# EAGLE design stm32-2inch40-usb-sd (EAGLE 6.6.0)
USB/SD 40 pin mesonine module. 2 inch beetween pinheads.

## Sheet 1 of 2
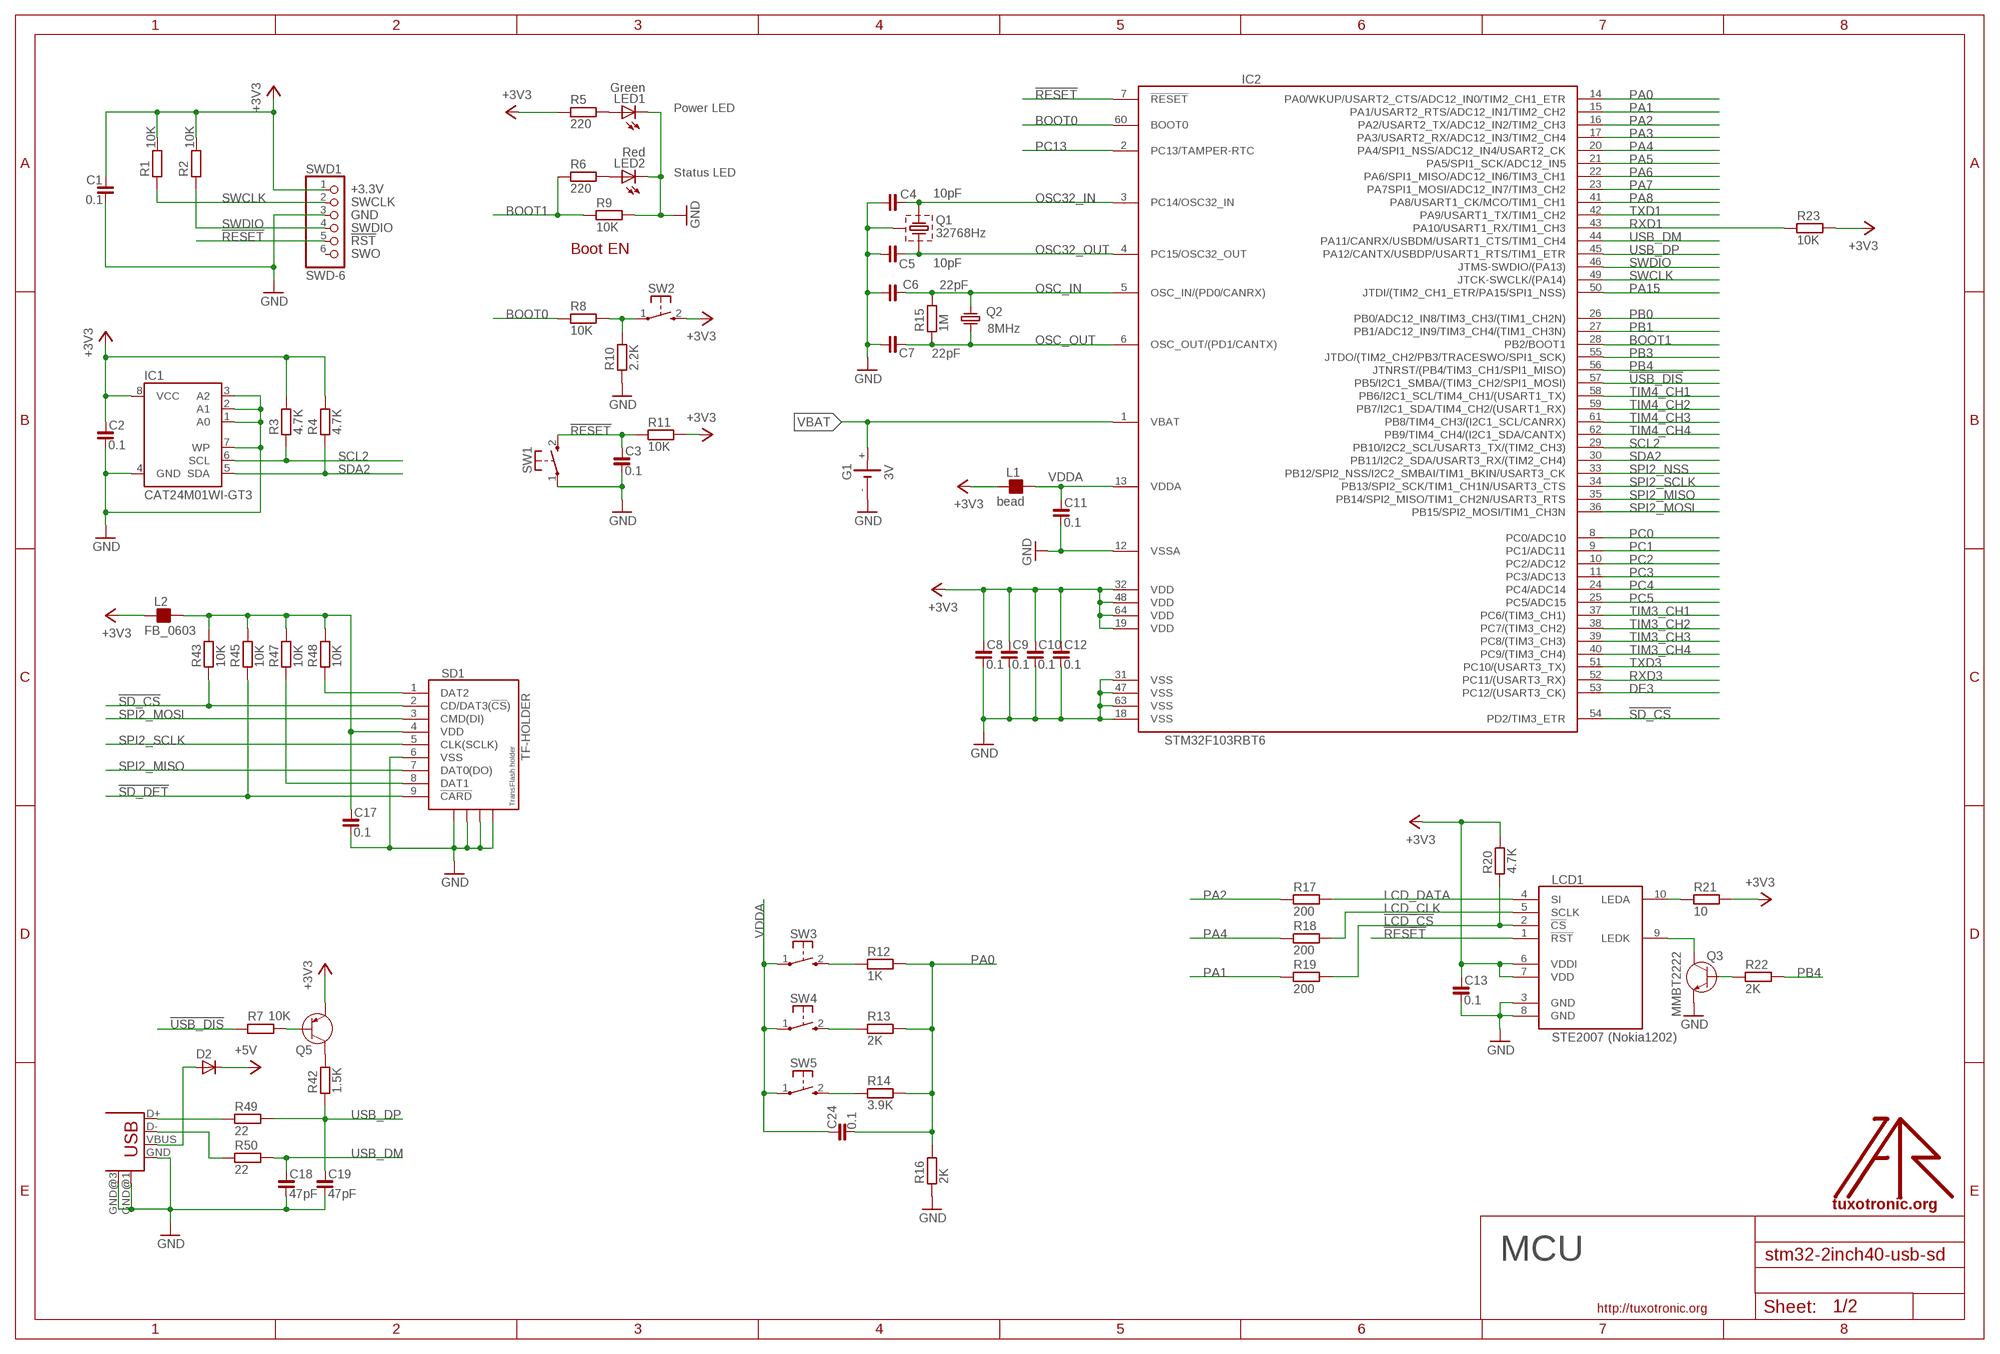
[diagram p0: schematic, sheet 1]

### Parts
C1  0.1  C_0603  [C0603]
C2  0.1  C_0603  [C0603]
C3  0.1  C_0603  [C0603]
C4  10pF  C_0603  [C0603]
C5  10pF  C_0603  [C0603]
C6  22pF  C_0603  [C0603]
C7  22pF  C_0603  [C0603]
C8  0.1  C_0603  [C0603]
C9  0.1  C_0603  [C0603]
C10  0.1  C_0603  [C0603]
C11  0.1  C_0603  [C0603]
C12  0.1  C_0603  [C0603]
C13  0.1  C_0603  [C0603]
C17  0.1  C_0603  [C0603]
C18  47pF  C_0603  [C0603]
C19  47pF  C_0603  [C0603]
C24  0.1  C_0603  [C0603]
D2  D-SOD-87  [SOD87]
G1  3V  1220SMT  [SMT1220]
IC1  CAT24M01WI-GT3  AT24C256S  [SO08]
IC2  STM32F103RBT6  STM32F103R  [TQFP64]
L1  bead  FB_0603  [L0603]
L2  FB_0603  [L0603]
LCD1  STE2007 (Nokia1202)  LCD1202-EXT  [NOKIA1202LCD-EXT]
LED1  Green  LEDCHIP-LED0805  [CHIP-LED0805]
LED2  Red  LEDCHIP-LED0805  [CHIP-LED0805]
Q1  32768Hz  CRSTL3-  [TC38H-G]
Q2  8MHz  CRYSTAL-HC49S  [HC49/S]
Q3  MMBT2222  [SOT23]
Q5  PNP-SOT23  [SOT23]
R1  10K  R_0603  [R0603]
R2  10K  R_0603  [R0603]
R3  4.7K  R_0603  [R0603]
R4  4.7K  R_0603  [R0603]
R5  220  R_0603  [R0603]
R6  220  R_0603  [R0603]
R7  10K  R_0603  [R0603]
R8  10K  R_0603  [R0603]
R9  10K  R_0603  [R0603]
R10  2.2K  R_0603  [R0603]
R11  10K  R_0603  [R0603]
R12  1K  R_0603  [R0603]
R13  2K  R_0603  [R0603]
R14  3.9K  R_0603  [R0603]
R15  1M  R_0603  [R0603]
R16  2K  R_0603  [R0603]
R17  200  R_0603  [R0603]
R18  200  R_0603  [R0603]
R19  200  R_0603  [R0603]
R20  4.7K  R_0603  [R0603]
R21  10  R_0603  [R0603]
R22  2K  R_0603  [R0603]
R23  10K  R_0603  [R0603]
R42  1.5K  R_0603  [R0603]
R43  10K  R_0603  [R0603]
R45  10K  R_0603  [R0603]
R47  10K  R_0603  [R0603]
R48  10K  R_0603  [R0603]
R49  22  R_0603  [R0603]
R50  22  R_0603  [R0603]
SD1  TF-HOLDER  [TF-PULL]
SW1  KSS-2EG4430  [KSS-2EG4430]
SW2  KSS-2EG4430  [KSS-2EG4430]
SW3  KSS-2EG4430  [KSS-2EG4430]
SW4  KSS-2EG4430  [KSS-2EG4430]
SW5  KSS-2EG4430  [KSS-2EG4430]
SWD1  SWD-6  [JTAG6PIN]
U$1  LOGO  [TT_LOGO]
USB1  USB-MB-S  [USB-MB-S]

### Nets
!LCD_CS: LCD1.2(!CS) R19.2 R20.1
!RESET: C3.1 IC2.7(!RESET) LCD1.1(!RST) R11.1 SW1.2(S) SWD1.5
!SD_CS: IC2.54(PD2/TIM3_ETR) R43.1 SD1.2(CD/DAT3(!CS!))
!SD_DET: R45.1 SD1.9(!CARD)
!USB_DIS: IC2.57(PB5/I2C1_SMBA/(TIM3_CH2/SPI1_MOSI)) R7.1
+3V3: C1.1 C2.1 C8.1 C9.1 C10.1 C12.1 C13.1 IC1.8(VCC) IC2.19(VDD) IC2.32(VDD) IC2.48(VDD) IC2.64(VDD) L1.1 L2.1 LCD1.6(VDDI) LCD1.7(VDD) Q5.2(E) R1.2 R2.2 R3.2 R4.2 R5.1 R11.2 R20.2 R21.2 R23.2 SW2.2(S) SWD1.1 ; also sheet 2
+5V: D2.1(C) ; also sheet 2
BOOT0: IC2.60(BOOT0) R8.1
BOOT1: IC2.28(PB2/BOOT1) R6.1 R9.1
DE3: IC2.53(PC12/(USART3_CK)) ; also sheet 2
GND: C1.2 C2.2 C3.2 C4.2 C5.2 C6.2 C7.2 C8.2 C9.2 C10.2 C11.2 C12.2 C13.2 C17.2 C18.2 C19.2 G1.- IC1.1(A0) IC1.2(A1) IC1.3(A2) IC1.4(GND) IC1.7(WP) IC2.12(VSSA) IC2.18(VSS) IC2.31(VSS) IC2.47(VSS) IC2.63(VSS) LCD1.3(GND) LCD1.8(GND) LED1.C LED2.C Q1.GND Q3.2(E) R9.2 R10.1 R16.1 SD1.6(VSS) SD1.S1 SD1.S2 SD1.S3 SD1.S4 SW1.1(P) SWD1.3 USB1.GND USB1.GND@1(GND) USB1.GND@3(GND) ; also sheet 2
LCD_CLK: LCD1.5(SCLK) R18.2
LCD_DATA: LCD1.4(SI) R17.2
N$1: Q5.3(C) R42.2
N$2: D2.2(A) USB1.VBUS
N$3: R8.2 R10.2 SW2.1(P)
N$7: C17.1 L2.2 R43.2 R45.2 R47.2 R48.2 SD1.4(VDD)
N$8: R48.1 SD1.1(DAT2)
N$9: R47.1 SD1.8(DAT1)
N$10: R49.1 USB1.D+
N$13: LED1.A R5.2
N$29: LCD1.9(LEDK) Q3.3(C)
N$30: LED2.A R6.2
N$31: LCD1.10(LEDA) R21.1
N$32: Q3.1(B) R22.1
N$33: R12.1 SW3.2(S)
N$34: R13.1 SW4.2(S)
N$35: R14.1 SW5.2(S)
N$36: R50.1 USB1.D-
N$38: Q5.1(B) R7.2
OSC32_IN: C4.1 IC2.3(PC14/OSC32_IN) Q1.2
OSC32_OUT: C5.1 IC2.4(PC15/OSC32_OUT) Q1.1
OSC_IN: C6.1 IC2.5(OSC_IN/(PD0/CANRX)) Q2.1 R15.2
OSC_OUT: C7.1 IC2.6(OSC_OUT/(PD1/CANTX)) Q2.2 R15.1
PA0: C24.2 IC2.14(PA0/WKUP/USART2_CTS/ADC12_IN0/TIM2_CH1_ETR) R12.2 R13.2 R14.2 R16.2 ; also sheet 2
PA1: IC2.15(PA1/USART2_RTS/ADC12_IN1/TIM2_CH2) R19.1 ; also sheet 2
PA2: IC2.16(PA2/USART2_TX/ADC12_IN2/TIM2_CH3) R17.1 ; also sheet 2
PA3: IC2.17(PA3/USART2_RX/ADC12_IN3/TIM2_CH4) ; also sheet 2
PA4: IC2.20(PA4/SPI1_NSS/ADC12_IN4/USART2_CK) R18.1 ; also sheet 2
PA5: IC2.21(PA5/SPI1_SCK/ADC12_IN5) ; also sheet 2
PA6: IC2.22(PA6/SPI1_MISO/ADC12_IN6/TIM3_CH1) ; also sheet 2
PA7: IC2.23(PA7SPI1_MOSI/ADC12_IN7/TIM3_CH2) ; also sheet 2
PA8: IC2.41(PA8/USART1_CK/MCO/TIM1_CH1) ; also sheet 2
PA15: IC2.50(JTDI/(TIM2_CH1_ETR/PA15/SPI1_NSS)) ; also sheet 2
PB0: IC2.26(PB0/ADC12_IN8/TIM3_CH3/(TIM1_CH2N)) ; also sheet 2
PB1: IC2.27(PB1/ADC12_IN9/TIM3_CH4/(TIM1_CH3N)) ; also sheet 2
PB3: IC2.55(JTDO/(TIM2_CH2/PB3/TRACESWO/SPI1_SCK)) ; also sheet 2
PB4: IC2.56(JTNRST/(PB4/TIM3_CH1/SPI1_MISO)) R22.2
PC0: IC2.8(PC0/ADC10) ; also sheet 2
PC1: IC2.9(PC1/ADC11) ; also sheet 2
PC2: IC2.10(PC2/ADC12) ; also sheet 2
PC3: IC2.11(PC3/ADC13) ; also sheet 2
PC4: IC2.24(PC4/ADC14) ; also sheet 2
PC5: IC2.25(PC5/ADC15) ; also sheet 2
PC13: IC2.2(PC13/TAMPER-RTC) ; also sheet 2
RXD1: IC2.43(PA10/USART1_RX/TIM1_CH3) R23.1 ; also sheet 2
RXD3: IC2.52(PC11/(USART3_RX)) ; also sheet 2
SCL2: IC1.6(SCL) IC2.29(PB10/I2C2_SCL/USART3_TX/(TIM2_CH3)) R3.1 ; also sheet 2
SDA2: IC1.5(SDA) IC2.30(PB11/I2C2_SDA/USART3_RX/(TIM2_CH4)) R4.1 ; also sheet 2
SPI2_MISO: IC2.35(PB14/SPI2_MISO/TIM1_CH2N/USART3_RTS) SD1.7(DAT0(DO)) ; also sheet 2
SPI2_MOSI: IC2.36(PB15/SPI2_MOSI/TIM1_CH3N) SD1.3(CMD(DI)) ; also sheet 2
SPI2_NSS: IC2.33(PB12/SPI2_NSS/I2C2_SMBAI/TIM1_BKIN/USART3_CK) ; also sheet 2
SPI2_SCLK: IC2.34(PB13/SPI2_SCK/TIM1_CH1N/USART3_CTS) SD1.5(CLK(SCLK)) ; also sheet 2
SWCLK: IC2.49(JTCK-SWCLK/(PA14)) R1.1 SWD1.2
SWDIO: IC2.46(JTMS-SWDIO/(PA13)) R2.1 SWD1.4
TIM3_CH1: IC2.37(PC6/(TIM3_CH1)) ; also sheet 2
TIM3_CH2: IC2.38(PC7/(TIM3_CH2)) ; also sheet 2
TIM3_CH3: IC2.39(PC8/(TIM3_CH3)) ; also sheet 2
TIM3_CH4: IC2.40(PC9/(TIM3_CH4)) ; also sheet 2
TIM4_CH1: IC2.58(PB6/I2C1_SCL/TIM4_CH1/(USART1_TX)) ; also sheet 2
TIM4_CH2: IC2.59(PB7/I2C1_SDA/TIM4_CH2/(USART1_RX)) ; also sheet 2
TIM4_CH3: IC2.61(PB8/TIM4_CH3/(I2C1_SCL/CANRX)) ; also sheet 2
TIM4_CH4: IC2.62(PB9/TIM4_CH4/(I2C1_SDA/CANTX)) ; also sheet 2
TXD1: IC2.42(PA9/USART1_TX/TIM1_CH2) ; also sheet 2
TXD3: IC2.51(PC10/(USART3_TX)) ; also sheet 2
USB_DM: C18.1 IC2.44(PA11/CANRX/USBDM/USART1_CTS/TIM1_CH4) R50.2
USB_DP: C19.1 IC2.45(PA12/CANTX/USBDP/USART1_RTS/TIM1_ETR) R42.1 R49.2
VBAT: G1.+ IC2.1(VBAT)
VDDA: C11.1 C24.1 IC2.13(VDDA) L1.2 SW3.1(P) SW4.1(P) SW5.1(P)
Unconnected: SWD1.6

### Notes on the sheet
- Power LED
- Status LED
- Boot EN
- MCU

## Sheet 2 of 2
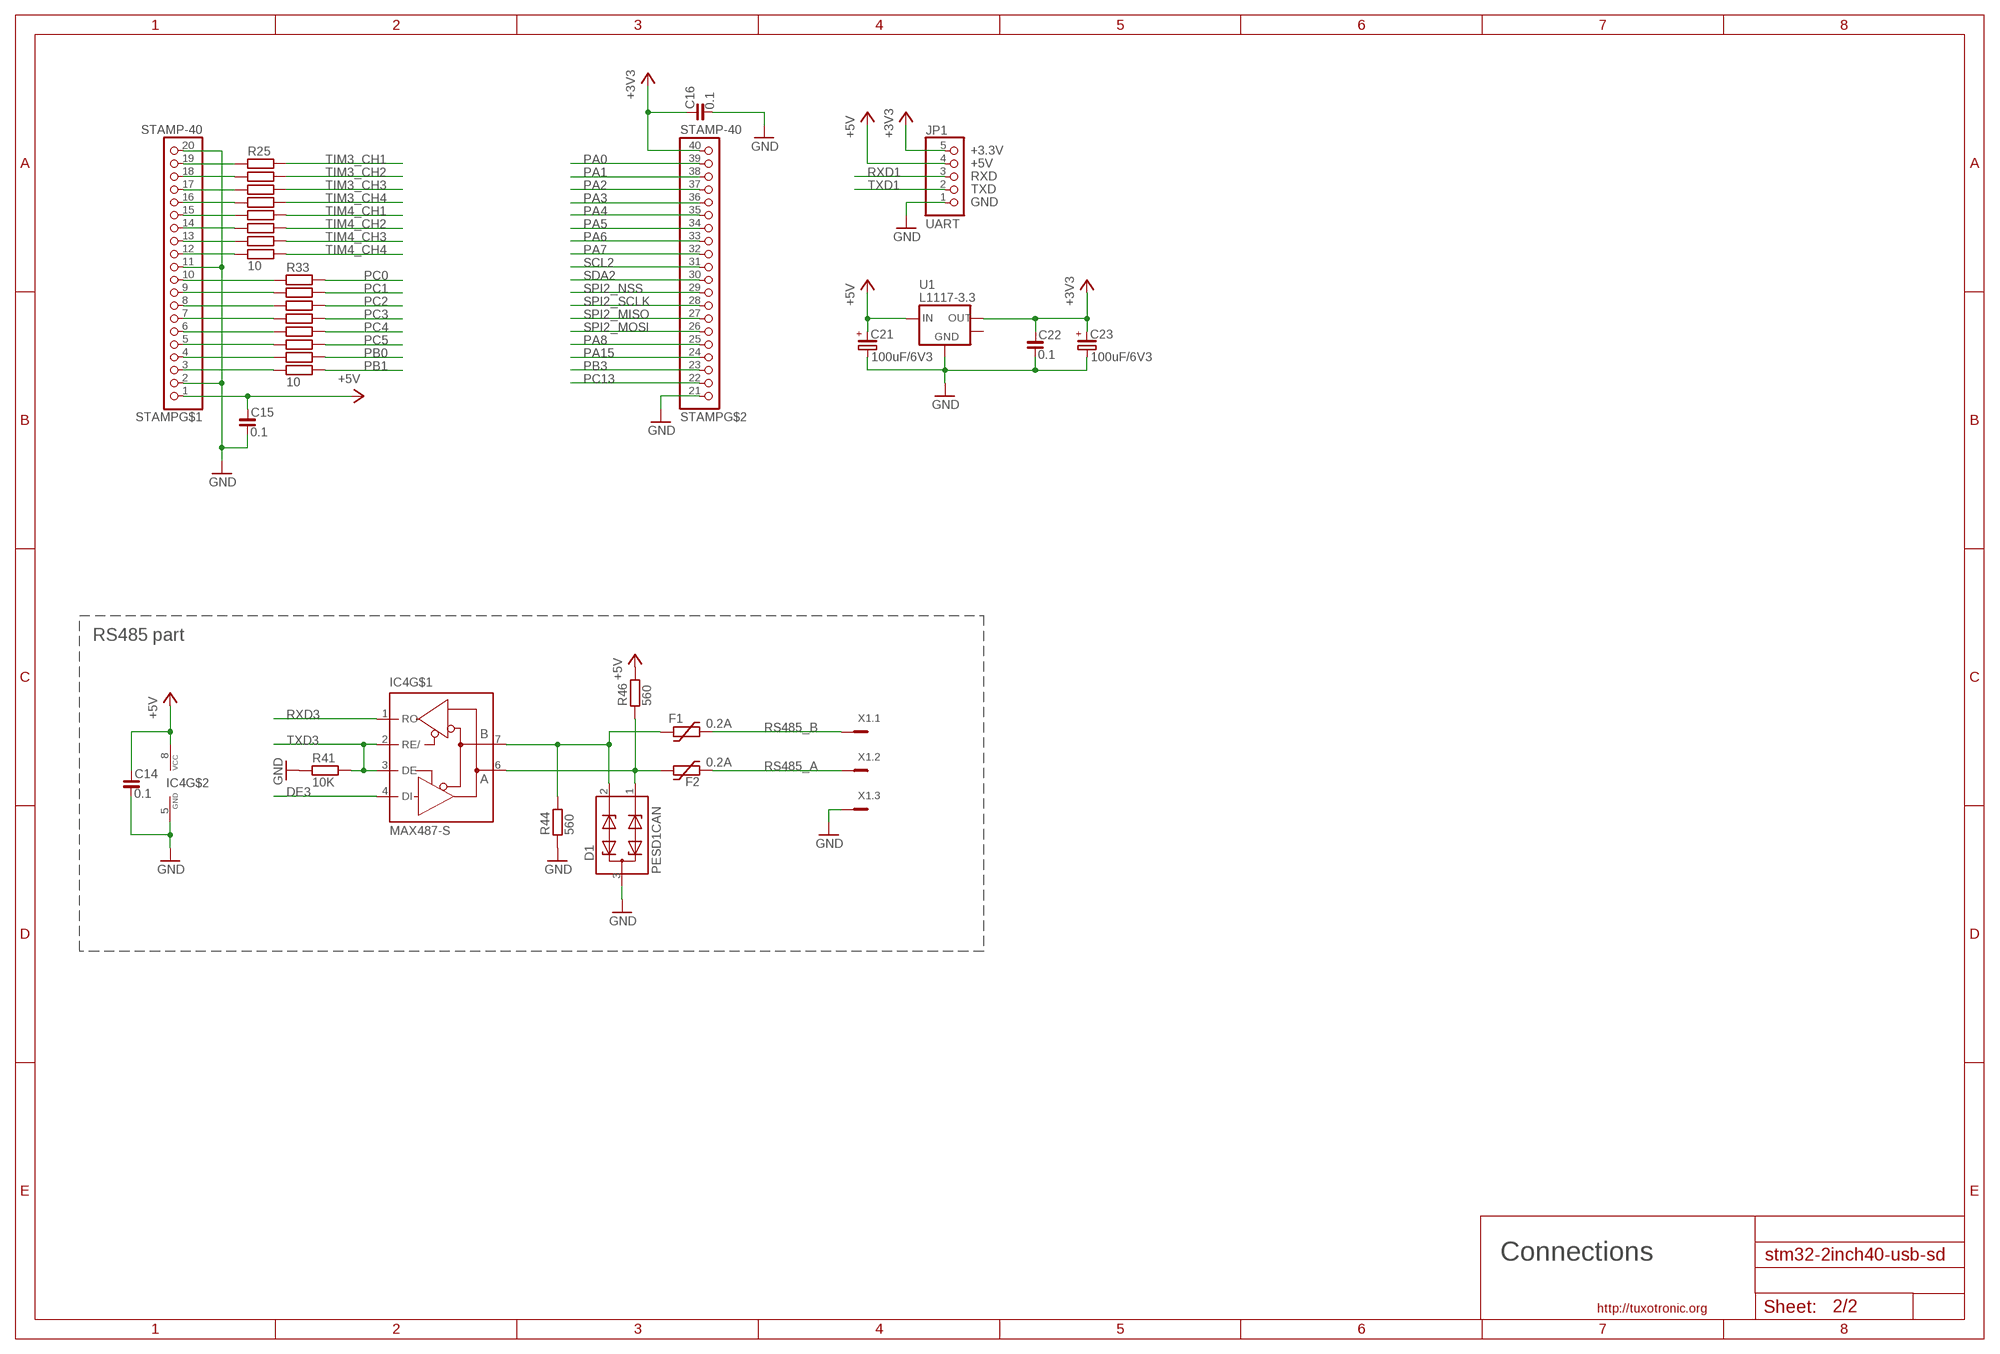
[diagram p1: schematic, sheet 2]

### Parts
C14  0.1  C_0603  [C0603]
C15  0.1  C_0805  [C0805]
C16  0.1  C_0805  [C0805]
C21  100uF/6V3  CP_SMCD  [SMC_D]
C22  0.1  C_0805  [C0805]
C23  100uF/6V3  CP_SMCD  [SMC_D]
D1  PESD1CAN  [SOT23]
F1  0.2A  1206L  [1206L]
F2  0.2A  1206L  [1206L]
IC4  MAX487-S  [SO08]
JP1  UART  UART-5_2.54  [UART_1X05]
R25  10  R_0603  [R0603]
R26  10  R_0603  [R0603]
R27  10  R_0603  [R0603]
R28  10  R_0603  [R0603]
R29  10  R_0603  [R0603]
R30  10  R_0603  [R0603]
R31  10  R_0603  [R0603]
R32  10  R_0603  [R0603]
R33  10  R_0603  [R0603]
R34  10  R_0603  [R0603]
R35  10  R_0603  [R0603]
R36  10  R_0603  [R0603]
R37  10  R_0603  [R0603]
R38  10  R_0603  [R0603]
R39  10  R_0603  [R0603]
R40  10  R_0603  [R0603]
R41  10K  R_0603  [R0603]
R44  560  R_0603  [R0603]
R46  560  R_0603  [R0603]
STAMP  STAMP-40  [STAMP-40]
U1  L1117-3.3  LM1117-3.3  [SOT223]
X1  MCV3  [MCV3]

### Nets
+3V3: C16.1 C22.1 C23.+ JP1.5 STAMP.40 U1.2(OUT) ; also sheet 1
+5V: C14.1 C15.1 C21.+ IC4.8(VCC) JP1.4 R46.2 STAMP.1 U1.3(IN) ; also sheet 1
DE3: IC4.4(DI) ; also sheet 1
GND: C14.2 C15.2 C16.2 C21.- C22.2 C23.- D1.3 IC4.5(GND) JP1.1 R41.1 R44.1 STAMP.2 STAMP.11 STAMP.20 STAMP.21 U1.1(GND) X1.3 ; also sheet 1
N$6: D1.2 F1.P$1 IC4.7(B) R44.2
N$11: R33.1 STAMP.10
N$14: R34.1 STAMP.9
N$15: R25.1 STAMP.19
N$16: R26.1 STAMP.18
N$17: R27.1 STAMP.17
N$18: R28.1 STAMP.16
N$19: R29.1 STAMP.15
N$20: R30.1 STAMP.14
N$21: R31.1 STAMP.13
N$22: R32.1 STAMP.12
N$23: R35.1 STAMP.8
N$24: R36.1 STAMP.7
N$25: R37.1 STAMP.6
N$26: R38.1 STAMP.5
N$27: R39.1 STAMP.4
N$28: R40.1 STAMP.3
N$44: D1.1 F2.P$1 IC4.6(A) R46.1
PA0: STAMP.39 ; also sheet 1
PA1: STAMP.38 ; also sheet 1
PA2: STAMP.37 ; also sheet 1
PA3: STAMP.36 ; also sheet 1
PA4: STAMP.35 ; also sheet 1
PA5: STAMP.34 ; also sheet 1
PA6: STAMP.33 ; also sheet 1
PA7: STAMP.32 ; also sheet 1
PA8: STAMP.25 ; also sheet 1
PA15: STAMP.24 ; also sheet 1
PB0: R39.2 ; also sheet 1
PB1: R40.2 ; also sheet 1
PB3: STAMP.23 ; also sheet 1
PC0: R33.2 ; also sheet 1
PC1: R34.2 ; also sheet 1
PC2: R35.2 ; also sheet 1
PC3: R36.2 ; also sheet 1
PC4: R37.2 ; also sheet 1
PC5: R38.2 ; also sheet 1
PC13: STAMP.22 ; also sheet 1
RS485_A: F2.P$2 X1.2
RS485_B: F1.P$2 X1.1
RXD1: JP1.3 ; also sheet 1
RXD3: IC4.1(RO) ; also sheet 1
SCL2: STAMP.31 ; also sheet 1
SDA2: STAMP.30 ; also sheet 1
SPI2_MISO: STAMP.27 ; also sheet 1
SPI2_MOSI: STAMP.26 ; also sheet 1
SPI2_NSS: STAMP.29 ; also sheet 1
SPI2_SCLK: STAMP.28 ; also sheet 1
TIM3_CH1: R25.2 ; also sheet 1
TIM3_CH2: R26.2 ; also sheet 1
TIM3_CH3: R27.2 ; also sheet 1
TIM3_CH4: R28.2 ; also sheet 1
TIM4_CH1: R29.2 ; also sheet 1
TIM4_CH2: R30.2 ; also sheet 1
TIM4_CH3: R31.2 ; also sheet 1
TIM4_CH4: R32.2 ; also sheet 1
TXD1: JP1.2 ; also sheet 1
TXD3: IC4.2(RE/) IC4.3(DE) R41.2 ; also sheet 1
Unconnected: U1.4(MASS)

### Notes on the sheet
- RS485 part
- Connections

## Library data of the parts
C1-C19 C22 C24 = rc-master-smd:C_: NON-POLARIZED CAP
C21 C23 = rc-master-smd:CP_: POLARIZED CAP
D1 = protect:PESD1CAN: Features Due to the integrated diode structure only one small SOT23 package is needed to protect two CAN bus lines Max. peak pulse power: PPP = 200 W at tp = 8/20 ?s Low clamping voltage: VCL = 40 V at IPP = 1 A Ultra low leakage current: IRM < 1 nA ESD protection up to 23 kV IEC 61000-4-2, level 4 (ESD) IEC 61000-4-5 (surge); IPP = 3 A at tp = 8/20 ?s Small SMD plastic package Applications CAN bus protection Automotive applications
D2 = semicon-smd-ipc:D-: DIODE unfilled
F1 F2 = ptc-littlefuse:1206L
G1 = battery:1220SMT
IC1 = stm32-by-pb:AT24C*: 2-wire serial EEPROM
IC2 = stm32:STM32F103R: Medium-density performance line ARM-based 32-bit MCU with 64 or 128 KB Flash, USB, CAN, 7 timers, 2 ADCs, 9 communication interfaces
IC4 = rs232-rs485:MAX487: RS485 TRANSEIVER
JP1 = stamp:UART-5: PIN HEADER
L1 L2 = rc-master-smd:FB_: FERRITE BEAD
LCD1 = lcd1202:LCD1202: 1.3" b/w graphics display 96x68 pixel. From Nokia 1202 cell phone
LED1 LED2 = led:LED: LED OSRAM: - CHIPLED LG R971, LG N971, LY N971, LG Q971, LY Q971, LO R971, LY R971 LH N974, LH R974 LS Q976, LO Q976, LY Q976 LO Q996 - Hyper CHIPLED LW Q18S LB Q993, LB Q99A, LB R99A - SideLED LS A670, LO A670, LY A670, LG A670, LP A670 LB A673, LV A673, LT A673, LW A673 LH A674 LY A675 LS A676, LA A676, LO A676, LY A676, LW A676 LS A679, LY A679, LG A679 - Hyper Micro SIDELED® LS Y876, LA Y876, LO Y876, LY Y876 LT Y87S - SmartLED LW L88C, LW L88S LB L89C, LB L89S, LG L890 LS L89K, LO L89K, LY L89K LS L896, LA L896, LO L896, LY L896 - TOPLED LS T670, LO T670, LY T670, LG T670, LP T670 LSG T670, LSP T670, LSY T670, LOP T670, LYG T670 LG T671, LOG T671, LSG T671 LB T673, LV T673, LT T673, LW T673 LH T674 LS T676, LA T676, LO T676, LY T676, LB T676, LH T676, LSB T676, LW T676 LB T67C, LV T67C, LT T67C, LS T67K, LO T67K, LY T67K, LW E67C LS E67B, LA E67B, LO E67B, LY E67B, LB E67C, LV E67C, LT E67C LW T67C LS T679, LY T679, LG T679 LS T770, LO T770, LY T770, LG T770, LP T770 LB T773, LV T773, LT T773, LW T773 LH T774 LS E675, LA E675, LY E675, LS T675 LS T776, LA T776, LO T776, LY T776, LB T776 LHGB T686 LT T68C, LB T68C - Hyper Mini TOPLED® LB M676 - Mini TOPLED Santana® LG M470 LS M47K, LO M47K, LY M47K Source: http://www.osram.convergy.de - LUMILED® LXK2-PW12-R00, LXK2-PW12-S00, LXK2-PW14-U00, LXK2-PW14-V00 LXK2-PM12-R00, LXK2-PM12-S00, LXK2-PM14-U00 LXK2-PE12-Q00, LXK2-PE12-R00, LXK2-PE12-S00, LXK2-PE14-T00, LXK2-PE14-U00 LXK2-PB12-K00, LXK2-PB12-L00, LXK2-PB12-M00, LXK2-PB14-N00, LXK2-PB14-P00, LXK2-PB14-Q00 LXK2-PR12-L00, LXK2-PR12-M00, LXK2-PR14-Q00, LXK2-PR14-R00 LXK2-PD12-Q00, LXK2-PD12-R00, LXK2-PD12-S00 LXK2-PH12-R00, LXK2-PH12-S00 LXK2-PL12-P00, LXK2-PL12-Q00, LXK2-PL12-R00 Source: www.luxeon.com
Q1 = crystal:CRSTL3-
Q2 = discrete:CRYSTAL-: CRYSTAL
Q3 = semiconductor:MMBT2222: General Purpose Transistors NPN Silicon Rating MMBT2222LT1G MMBT2222ALT1G Collector-Emitter Voltage (VCEO) 30 Vdc 40 Vdc Collector-Base Voltage (VCBO) 60 Vdc 75 Vdc Emitter-Base Voltage (VEBO) 5.0 Vdc 6.0 Vdc Collector Current Continuous (IC) 600 mAdc 1100 mAdc Collector Current Peak (ICM) 600 mAdc 1100 mAdc
Q5 = semiconductor:PNP-
R1-R23 R25-R50 = rc-master-smd:R_: RESISTOR
SD1 = sd-mmc:TF-HOLDER: TF / Micro SD socket is PUSH-PUSH type, the card can be pushed into and auto locked and pushed out by simply press the card. Surface Mounting type.
STAMP = stamp:STAMP-40
SW1-SW5 = buttons:KSS-2EG4430: Size: 3x6mm Height: 5mm from PCB Rating: DC12v 50mA Travel: 0.25±0.10mm Operating Force: 180±50gf Return Force: 60gf min Contact resistance: 100m? max Insulation resistance: 100M? min Operating life?50,000 cycles
SWD1 = jtag:SWD-6: STM32Fx Discovery
U1 = vreg-linear:LM1117: Linear regulators
U$1 = logo:LOGO
USB1 = usb:USB: USB Connectors
X1 = con-phoenix-381_l:MCV3: Mini-Combicon 3.81mm vertikal 3polig (ohne Gegenstecker)

## Net classes
0 default: width 0.1 mm, drill 0.1 mm, clearance 0.1 mm

## Board
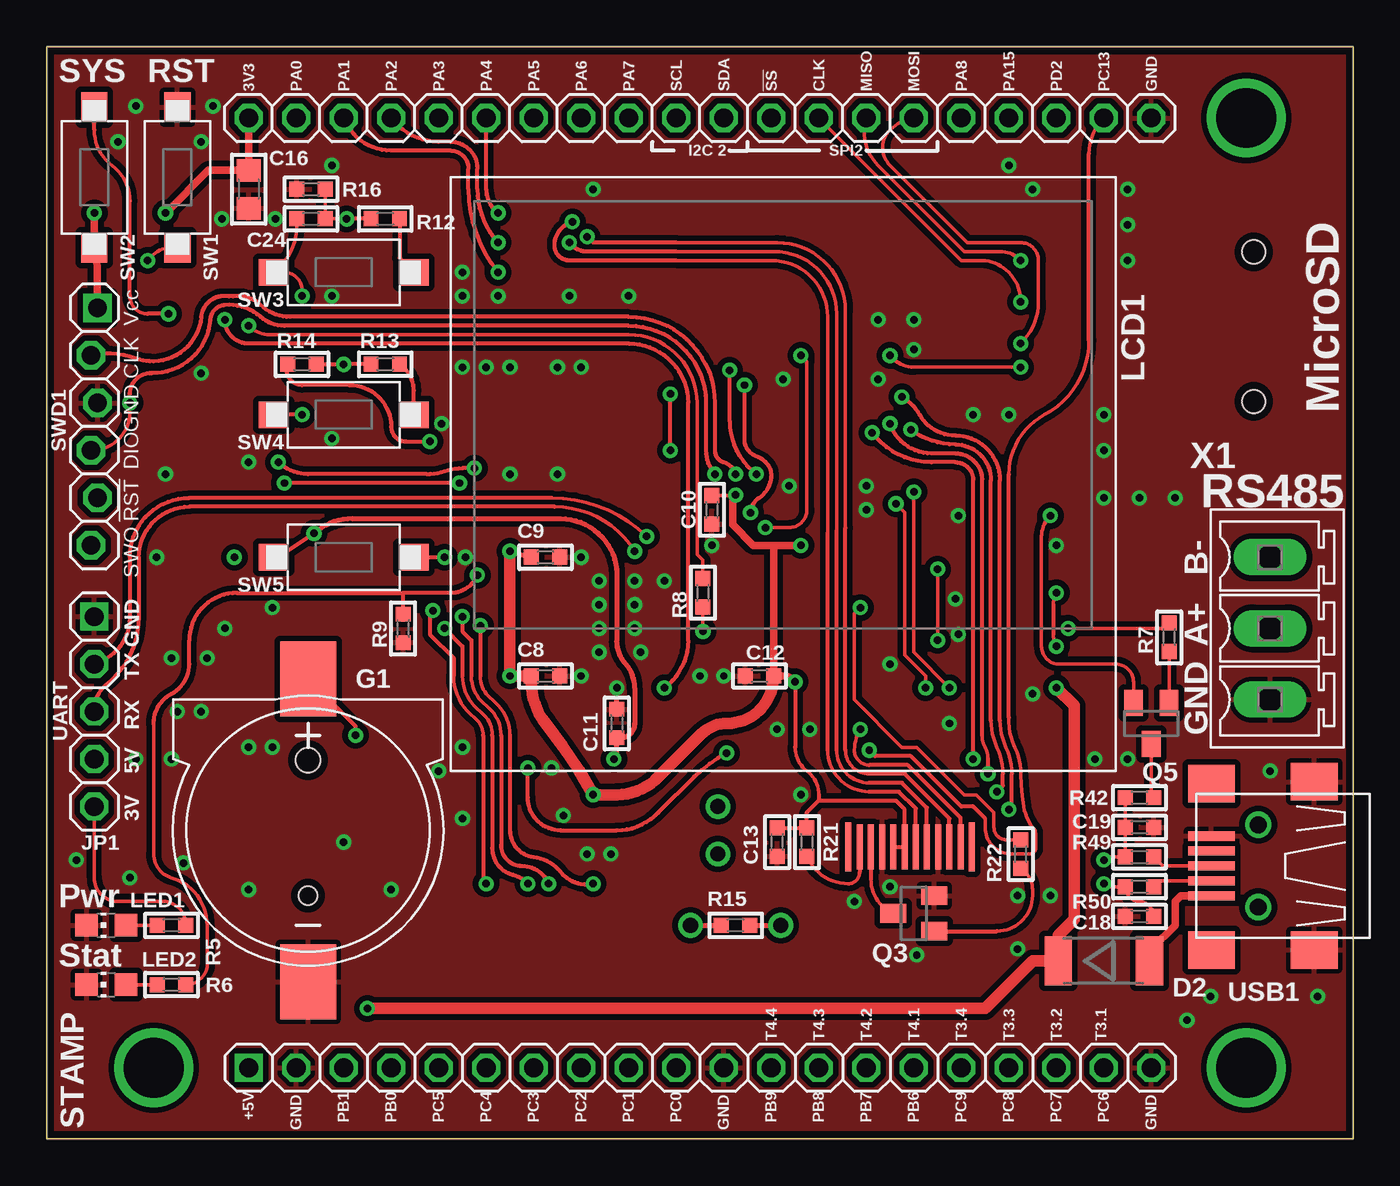
[diagram p2: board, top side]
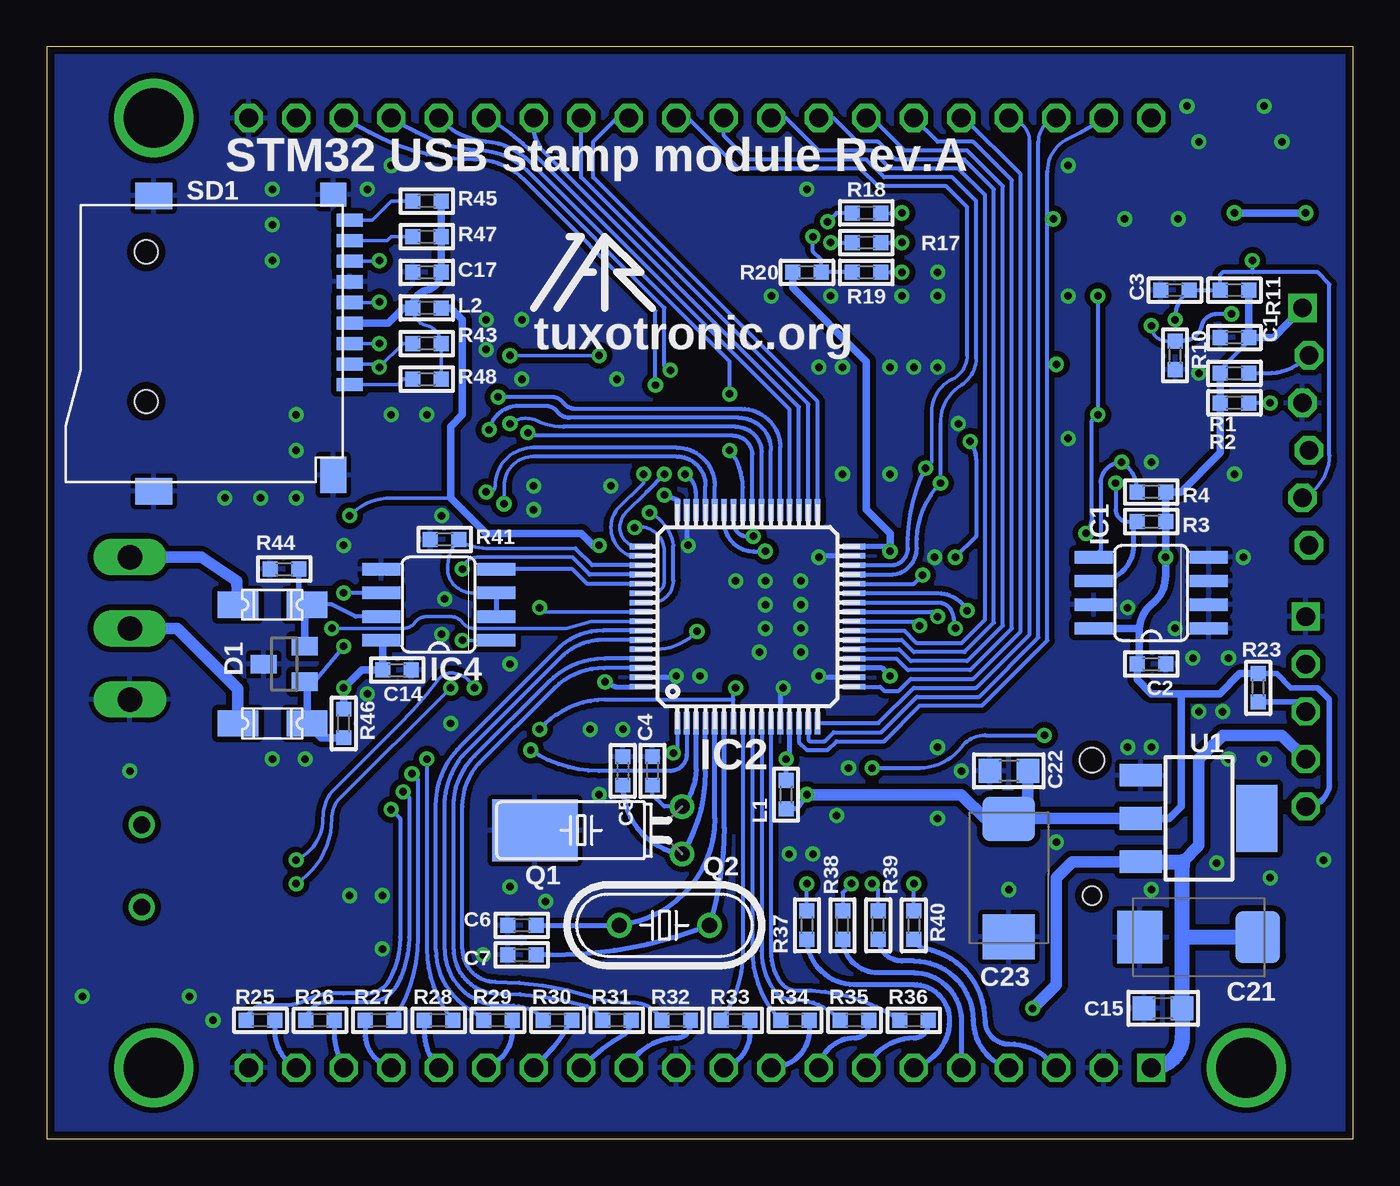
[diagram p3: board, bottom side, seen from below]

Size 69.85 x 58.42 mm. Coordinates in mm from the lower left corner, seen from the top.
Outline: 69.85,0 0,0 0,58.42 69.85,58.42 69.85,0
Copper layers (1*16): Top 0.035mm / dielectric 1.5mm / Bottom 0.035mm
Design rules "default *": minimum track width 0.16mm, minimum drill 0.4mm, track to track 0.16mm, track to pad 0.16mm, pad to pad 0.16mm, via to via 0.16mm, smd to smd 0.16mm, copper to edge 0.4mm, drill to drill 8mil, minimum pad ring 10mil, minimum via ring 8mil, stop-mask expansion 4mil, vias tented up to drill 0.6mm, thermal gap 10mil

### Footprints (pad centres in the part's own frame; a part is rotated, then mirrored left to right if it is on the bottom)
C0603 = smd 0.8 x 0.8: 1 -0.762,0; 2 0.762,0
C0805 = smd 1.2 x 1.3: 1 -1.016,0; 2 1.016,0
SMC_D = smd 2.4 x 2.8: + -3.15,0; - 3.15,0
SOT23 = smd 1 x 1.4: 1 -0.95,-1.1; 2 0.95,-1.1; 3 0,1.1
SOD87 = smd 1.45 x 2.6: 1 -2.445,0; 2 2.445,0
1206L = smd 2.16 x 1.4: P$1 -1.85,0; P$2 1.85,0
SMT1220 = smd 4 x 3: + -8.1,0; - 8.1,0 | hole 1: 3.5,0 | hole 1.3: -3.75,0
SO08 = smd 0.66 x 2.032: 1 -1.905,-3.073; 2 -0.635,-3.073; 3 0.635,-3.073; 4 1.905,-3.073; 5 1.905,3.073; 6 0.635,3.073; 7 -0.635,3.073; 8 -1.905,3.073
TQFP64 = smd 1.2 x 0.3: 1 -5.7,3.75; 2 -5.7,3.25; 3 -5.7,2.75; 4 -5.7,2.25; 5 -5.7,1.75; 6 -5.7,1.25; 7 -5.7,0.75; 8 -5.7,0.25; 9 -5.7,-0.25; 10 -5.7,-0.75; 11 -5.7,-1.25; 12 -5.7,-1.75; 13 -5.7,-2.25; 14 -5.7,-2.75; 15 -5.7,-3.25; 16 -5.7,-3.75; 33 5.7,-3.75; 34 5.7,-3.25; 35 5.7,-2.75; 36 5.7,-2.25; 37 5.7,-1.75; 38 5.7,-1.25; 39 5.7,-0.75; 40 5.7,-0.25; 41 5.7,0.25; 42 5.7,0.75; 43 5.7,1.25; 44 5.7,1.75; 45 5.7,2.25; 46 5.7,2.75; 47 5.7,3.25; 48 5.7,3.75 | smd 0.3 x 1.2: 17 -3.75,-5.7; 18 -3.25,-5.7; 19 -2.75,-5.7; 20 -2.25,-5.7; 21 -1.75,-5.7; 22 -1.25,-5.7; 23 -0.75,-5.7; 24 -0.25,-5.7; 25 0.25,-5.7; 26 0.75,-5.7; 27 1.25,-5.7; 28 1.75,-5.7; 29 2.25,-5.7; 30 2.75,-5.7; 31 3.25,-5.7; 32 3.75,-5.7; 49 3.75,5.7; 50 3.25,5.7; 51 2.75,5.7; 52 2.25,5.7; 53 1.75,5.7; 54 1.25,5.7; 55 0.75,5.7; 56 0.25,5.7; 57 -0.25,5.7; 58 -0.75,5.7; 59 -1.25,5.7; 60 -1.75,5.7; 61 -2.25,5.7; 62 -2.75,5.7; 63 -3.25,5.7; 64 -3.75,5.7
UART_1X05 = drill 1 square: 1 -5.08,0 | drill 1 octagon: 2 -2.54,0; 3 0,0; 4 2.54,0; 5 5.08,0
L0603 = smd 0.8 x 0.8: 1 -0.762,0; 2 0.762,0
NOKIA1202LCD-EXT = smd 0.32 x 2.6: 0 -10.09,23.114; 11 -3.49,23.114 | smd 0.32 x 2.4: 1 -9.49,23.114; 2 -8.89,23.114; 3 -8.29,23.114; 4 -7.69,23.114; 5 -7.09,23.114; 6 -6.49,23.114; 7 -5.89,23.114; 8 -5.29,23.114; 9 -4.69,23.114; 10 -4.09,23.114
CHIP-LED0805 = smd 1.2 x 1.2: A 0,-1.05; C 0,1.05
TC38H-G = drill 0.8: 1 -1.27,0; 2 1.27,0 | smd 3.302 x 4.572: GND 0,7.874
HC49/S = drill 0.813: 1 -2.413,0; 2 2.413,0
R0603 = smd 0.8 x 0.8: 1 -0.762,0; 2 0.762,0
TF-PULL = smd 0.7 x 1.4: 1 -2.2,-7.62; 2 -1.1,-7.62; 3 0,-7.62; 4 1.1,-7.62; 5 2.2,-7.62; 6 3.3,-7.62; 7 4.4,-7.62; 8 5.5,-7.62; 9 6.6,-7.62 | smd 1.4 x 2: S1 -7.9,2.85; S2 7.9,2.85 | smd 1.28 x 1.4: S3 7.96,-6.75 | smd 1.95 x 1.4: S4 -7.025,-6.75 | hole 1.25: -3.1,3.25; 4.9,3.25
STAMP-40 = drill 1 square: 1 -24.13,-25.4 | drill 1 octagon: 2 -21.59,-25.4; 3 -19.05,-25.4; 4 -16.51,-25.4; 5 -13.97,-25.4; 6 -11.43,-25.4; 7 -8.89,-25.4; 8 -6.35,-25.4; 9 -3.81,-25.4; 10 -1.27,-25.4; 11 1.27,-25.4; 12 3.81,-25.4; 13 6.35,-25.4; 14 8.89,-25.4; 15 11.43,-25.4; 16 13.97,-25.4; 17 16.51,-25.4; 18 19.05,-25.4; 19 21.59,-25.4; 20 24.13,-25.4; 21 24.13,25.4; 22 21.59,25.4; 23 19.05,25.4; 24 16.51,25.4; 25 13.97,25.4; 26 11.43,25.4; 27 8.89,25.4; 28 6.35,25.4; 29 3.81,25.4; 30 1.27,25.4; 31 -1.27,25.4; 32 -3.81,25.4; 33 -6.35,25.4; 34 -8.89,25.4; 35 -11.43,25.4; 36 -13.97,25.4; 37 -16.51,25.4; 38 -19.05,25.4; 39 -21.59,25.4; 40 -24.13,25.4
KSS-2EG4430 = smd 1.6 x 1.4: 1 -3.75,0; 2 3.75,0
JTAG6PIN = drill 1 square: 1 -6.35,0.178 | drill 1 octagon: 2 -3.81,-0.178; 3 -1.27,0.178; 4 1.27,-0.178; 5 3.81,0.178; 6 6.35,-0.178
SOT223 = smd 1.219 x 2.235: 1 -2.311,-3.099; 2 0,-3.099; 3 2.311,-3.099 | smd 3.6 x 2.2: 4 0,3.099
USB-MB-S = smd 2.5 x 0.5: D+ 2.5,0; D- 2.5,0.8; GND 2.5,-1.6; ID 2.5,-0.8; VBUS 2.5,1.6 | smd 2.5 x 2: GND@1 -3,4.5; GND@2 2.5,4.5; GND@3 -3,-4.5; GND@4 2.5,-4.4 | drill 0.9: P$5 0,2.2; P$6 0,-2.2
MCV3 = drill 1.3 pad 1.905 long: 1 -3.81,0; 2 0,0; 3 3.81,0

### Placement (x,y rotation side)
C1  6.35,42.86 180 bottom
C2  10.79,25.4 0 bottom
C3  9.53,45.4 180 bottom
C4  37.47,19.68 90 bottom
C5  39.05,19.68 90 bottom
C6  44.45,11.43 180 bottom
C7  44.45,9.84 180 bottom
C8  26.67,24.77 0 top
C9  26.67,31.11 0 top
C10  35.56,33.66 270 top
C11  30.48,22.23 90 top
C12  38.1,24.77 180 top
C13  39.05,15.88 270 top
C14  51.12,25.08 0 bottom
C15  10.16,6.99 180 bottom
C16  10.79,50.8 270 top
C17  49.53,46.35 180 bottom
C18  58.42,11.91 180 top
C19  58.42,16.67 0 top
C21  8.26,10.79 180 bottom
C22  18.41,19.68 180 bottom
C23  18.41,13.97 270 bottom
C24  14.13,49.21 0 top
D1  57.15,25.4 90 bottom
D2  56.52,9.53 0 top
F1  57.78,28.57 180 bottom
F2  57.78,22.23 180 bottom
G1  13.97,16.51 270 top
IC1  10.79,29.21 90 bottom
IC2  32.38,27.94 90 bottom
IC4  48.9,28.57 90 bottom
JP1  2.54,22.86 270 top
L1  30.32,18.41 90 bottom
L2  49.53,44.45 180 bottom
LCD1  39.37,38.73 180 top
LED1  3.17,11.43 90 top
LED2  3.17,8.26 90 top
Q1  35.88,16.51 90 bottom
Q2  36.83,11.43 0 bottom
Q3  46.35,12.06 90 top
Q5  59.05,22.23 180 top
R1  6.35,40.96 180 bottom
R2  6.35,39.37 180 bottom
R3  10.79,33.02 0 bottom
R4  10.79,34.61 0 bottom
R5  6.67,11.43 180 top
R6  6.67,8.26 180 top
R7  60.01,26.83 270 top
R8  35.08,29.21 90 top
R9  19.05,27.3 270 top
R10  9.53,41.91 90 bottom
R11  6.35,45.4 0 bottom
R12  18.1,49.21 180 top
R13  18.1,41.43 180 top
R14  13.65,41.43 0 top
R15  36.83,11.43 0 top
R16  14.13,50.8 0 top
R17  26.04,47.94 180 bottom
R18  26.04,49.53 180 bottom
R19  26.04,46.35 180 bottom
R20  29.21,46.35 180 bottom
R21  40.64,15.88 90 top
R22  52.07,15.24 90 top
R23  5.08,24.13 90 bottom
R25  58.42,6.35 180 bottom
R26  55.24,6.35 180 bottom
R27  52.07,6.35 0 bottom
R28  48.9,6.35 0 bottom
R29  45.72,6.35 180 bottom
R30  42.55,6.35 180 bottom
R31  39.37,6.35 180 bottom
R32  36.2,6.35 180 bottom
R33  33.02,6.35 180 bottom
R34  29.84,6.35 180 bottom
R35  26.67,6.35 180 bottom
R36  23.5,6.35 180 bottom
R37  29.21,11.43 90 bottom
R38  27.3,11.43 90 bottom
R39  25.4,11.43 90 bottom
R40  23.5,11.43 90 bottom
R41  48.58,32.07 0 bottom
R42  58.42,18.26 0 top
R43  49.53,42.55 0 bottom
R44  57.15,30.48 0 bottom
R45  49.53,50.16 0 bottom
R46  53.98,22.23 90 bottom
R47  49.53,48.26 0 bottom
R48  49.53,40.64 0 bottom
R49  58.42,15.08 180 top
R50  58.42,13.49 180 top
SD1  61.28,42.55 90 bottom
STAMP  34.92,29.21 0 top
SW1  6.99,51.44 270 top
SW2  2.54,51.44 270 top
SW3  15.88,46.35 0 top
SW4  15.88,38.73 0 top
SW5  15.88,31.11 0 top
SWD1  2.54,38.1 270 top
U1  8.26,17.14 270 bottom
U$1  40.01,46.99 0 bottom
USB1  64.77,14.61 180 top
X1  65.41,27.3 270 top

### Tracks (layer width: path | path; a pad name or v marks a point on that pad's centre or on a via)
!LCD_CS  (via drill 0.4)
  Top 0.2: 43.97,19.53 arc-90 42.7,20.8 | 42.7,32.7 42.7,44.29 arc90 39.05,47.94 33.66,47.94
  Top 0.203: LCD1.2 48.26,17.14 45.88,19.53 43.97,19.53 | 42.7,20.8 42.7,32.7 | 33.66,47.94 29.21,47.94 v28.89,48.26
  Bottom 0.203: R19.2 R20.1 28.45,47.02 28.89,47.47 v28.89,48.26
!RESET  (via drill 0.4)
  Top 0.2: 43.97,20 arc-90 43.18,20.8 arc-32 v43.5,21.91 | 6.73,47.69 arc55 v5.4,46.99
  Top 0.203: v9.53,43.81 arc90 10.79,42.55 31.11,42.55 arc-90 34.29,39.37 34.29,26.67 arc-53 v33.02,24.13 | SW1.2 6.73,47.69 | LCD1.1 48.86,17.18 46.04,20 43.97,20
  Bottom 0.2: 1.27,36.54 arc64 SWD1.5
  Bottom 0.203: 1.27,36.54 1.27,45.72 1.91,46.35 5.4,46.35 | IC2.7 33.13,23.5 | 33.13,23.5 33.13,24.02 v33.02,24.13 | v9.53,43.81 arc51 C3.1 R11.1 7.11,46.23 6.99,46.35 5.4,46.35 | v5.4,46.99 5.4,46.35 | 33.13,23.5 40.01,23.5 arc-49 v43.5,21.91
  Bottom 0.254: R11.1 | 6.99,45.53 R11.1
!SD_CS  (via drill 0.4)
  Top 0.2: v38.42,32.7 39.69,32.7 arc90 40.64,33.66 40.64,41.59 v40.32,41.91 | v52.07,41.27 46.35,41.27 arc-53 v45.09,41.91
  Bottom 0.2: IC2.54 37.48,29.19 arc-90 36.83,29.84 36.83,31.43 arc-103 v38.42,32.7 | SD1.2 52.24,41.45 v52.07,41.27 50.8,42.55 R43.1 | v45.09,41.91 v40.32,41.91
!SD_DET
  Bottom 0.2: SD1.9 52.45,49.15 51.44,50.16 R45.1
!USB_DIS  (via drill 0.4)
  Top 0.2: v54.61,27.3 59.72,27.3 R7.1
  Bottom 0.2: v54.61,27.3 50.8,27.3 arc-53 50.16,27.62 arc53 49.53,27.94 48.26,27.94 arc53 47.62,27.62 arc-53 46.99,27.3 42.07,27.3 40.73,27.69 IC2.57
+3V3  (via drill 0.4)
  Top 0.2: 40.01,20.95 arc53 40.64,19.68 arc-53 41.27,18.41 | JP1.5 2.54,13.97 arc90 3.81,12.7 6.35,12.7 arc-85 R5.1 | Q5.2 58.1,24.45 arc90 57.15,25.4 54.13,25.4 arc-90 53.18,26.35 53.18,32.23 arc-46 v53.66,33.34
  Top 0.203: LCD1.7 LCD1.6 45.86,17.62 45.38,18.1 41.27,18.1 | 41.27,18.1 40.64,17.46 R21.2 C13.1 | v40.01,24.45 40.01,20.95 | 41.27,18.41 41.27,18.1 | C10.1 v36.83,34.45
  Top 0.254: v24.77,31.43 C9.1
  Top 0.406: v40.01,24.45 arc53 39.37,24.77 C12.1 38.86,31.62 38.73,31.75 | v36.83,34.45 36.67,34.29 36.67,32.86 37.78,31.75 38.73,31.75 | SWD1.1 2.67,47.56 SW2.2 v2.54,49.53 | STAMP.40 C16.1 8.64,51.82 v6.35,49.53 | v40.32,31.75 38.73,31.75
  Top 0.61: v24.77,31.43 v24.77,24.77 C8.1 25.91,24.42 arc38 26.67,22.23 arc-9 v29.21,18.41 | v29.21,18.41 | C12.1 arc-91 36.35,22.23 arc45 35,21.67 32.7,19.37 arc-46 30.48,18.41 v29.21,18.41
  Bottom 0.2: 48.26,34.29 51.44,34.29 arc-46 v53.66,33.34
  Bottom 0.203: R1.2 7.11,41.15 5.59,42.67
  Bottom 0.254: IC2.64 39.43,24.19 v40.01,24.45 | IC2.19 25.19,25.19 v24.77,24.77 | IC2.32 24.82,31.69 v24.77,31.43 | IC2.48 36.13,34.19 v36.83,34.45 | L1.1 29.72,17.65 v29.21,18.41 | 11.43,25.53 C2.1 | C1.1 5.59,42.67
  Bottom 0.305: JP1.5 arc-90 1.27,19.05 1.27,23.5 1.91,24.13 3.33,24.13 4.1,24.89 R23.2
  Bottom 0.406: IC1.8 11.43,27.3 | 11.43,27.3 11.43,25.53 | 11.43,27.3 arc51 10.79,28.57 arc-52 10.03,30.13 v10.03,31.11 R3.2 R4.2 9.21,34.61 7.11,36.7 R2.2 R1.2 | U1.2 9.84,17.14 9.21,17.78 9.21,23.81 | 9.21,23.81 7.14,23.81 6.06,24.89 R23.2 | 9.21,23.81 10.79,23.81 11.56,24.57 C2.1 | R20.2 29.97,45.53 26.04,41.59 26.04,33.66 24.77,32.38 v24.77,31.43 | R11.2 C1.1 4.25,42.86 SWD1.1 | v6.35,49.53 v2.54,49.53 | L2.1 48.26,44.45 47.62,43.81 47.62,38.73 48.26,38.1 48.26,34.29 46.35,32.38 41.27,32.38 40.64,31.75 v40.32,31.75
  Bottom 0.61: v29.21,18.41 20.95,18.41 19.68,17.14 18.39,17.14 | U1.2 18.39,17.14 | C22.1 17.4,18.14 18.39,17.14 | 18.39,17.14 C23.+
+5V  (via drill 0.4)
  Top 0.61: v17.14,6.99 50.16,6.99 52.7,9.53 D2.1 54.07,10.89 54.93,11.75 54.93,23.18 v53.98,24.13
  Bottom 0.406: R46.2 v53.98,24.13 53.02,25.08 C14.1 51.88,26.58 IC4.8
  Bottom 0.61: JP1.4 3.81,21.59 6.99,21.59 8.26,20.32 8.26,15.7 9.12,14.83 | U1.3 15.01,14.83 15.88,13.97 15.88,8.26 v17.14,6.99
  Bottom 0.813: 9.14,10.79 C15.1 9.14,5.46 arc90 STAMP.1 | 9.14,10.79 9.14,14.22 9.12,14.83 U1.3 | C21.+ 9.14,10.79
BOOT0  (via drill 0.4)
  Top 0.2: v35.08,27.15 R8.1 | R8.1
  Bottom 0.2: IC2.60 37.31,26.19 arc-46 v35.08,27.15
BOOT1  (via drill 0.4)
  Top 0.2: 5.71,22.23 5.71,15.24 arc74 6.67,13.97 arc-74 8.57,11.43 8.57,9.21 arc-82 R6.1
  Top 0.203: 19.05,29.21 10.16,29.21 arc90 7.62,26.67 7.62,25.4 arc-62 6.67,23.81 arc62 5.71,22.23 | R9.1 19.05,29.21 | 19.05,29.21 21.59,29.21 arc67 v23.02,30.16
  Bottom 0.203: IC2.28 23.49,29.69 v23.02,30.16
DE3
  Bottom 0.203: IC2.53 40.95,29.69 41.75,30.48 IC4.4
GND  (via drill 0.4)
  Top 0.254: C11.2 v30.48,24.13
  Bottom 0.254: IC2.31 28.5,31.19 v28.57,31.11 | IC2.47 35.63,31.82 v35.56,31.75 | IC2.63 36.27,24.69 v36.2,24.77 | IC2.18 28.5,24.69 v28.57,24.77 | IC2.12 30.64,23.98 v30.48,24.13
  other vias: 8.89,55.24 3.81,53.34 4.76,55.24 27.62,17.3 12.06,20.96 57.78,48.9 40.32,18.41 46.51,9.84 10.79,20.96 8.57,25.72 9.53,27.3 12.06,28.42 46.35,43.81 57.78,20.32 8.26,40.96 6.35,35.56 5.87,31.11 22.38,31.11 24.77,35.56 56.51,34.29 67.94,7.62 60.96,6.35 56.04,20.32 51.91,13.02 51.91,10.16 43.81,34.92 49.53,38.73 53.98,31.75 48.58,28.89 39.05,21.91 45.09,13.49 43.18,12.7 9.37,49.21 8.26,53.34 15.24,52.07 22.23,46.35 10.79,36.2 6.67,25.72 6.99,22.86 8.26,22.86 4.76,20.32 6.67,20.32 26.99,19.84 22.23,20.95 20.96,19.68 18.42,13.34 15.88,15.88 7.3,14.76 10.8,13.34 30.16,15.24 28.89,15.24 57.78,46.99 57.78,50.8 58.42,34.29 51.43,52.07 52.7,50.8 15.24,45.09 15.24,37.47 21.11,38.26 29.53,29.84 31.43,29.84 29.53,28.57 29.53,27.3 29.53,26.04 31.43,28.57 31.43,27.3 31.75,26.04 23.5,41.27 27.3,41.27 27.94,45.09 24.13,45.09 31.11,45.09 24.77,41.27 22.23,45.09 22.23,41.27 28.57,41.27 29.21,50.8 40.8,21.91 43.81,33.66 39.69,34.92 39.37,40.64 52.7,23.81 44.45,40.64 27.3,35.56 34.92,24.77 33.02,29.84 1.59,14.92 4.45,13.97 12.22,49.21 60.32,34.29 56.52,36.83 53.66,13.02 65.41,19.68 62.23,7.62 48.74,26.99 48.74,33.34 44.45,43.81 22.23,17.14 48.26,22.23 46.35,42.23 51.44,38.73 56.52,38.73 45.09,25.4
  pour Bottom (isolate 0.305): -0.64,-0.64 70.48,-0.64 70.48,59.05 -0.64,59.05
  pour Top (isolate 0.305): -1.27,-1.27 71.12,-1.27 71.12,59.69 -1.27,59.69
LCD_CLK  (via drill 0.4)
  Top 0.2: 43.97,18.57 arc-90 41.75,20.8 | 41.75,32.38 41.75,43.97 arc90 38.73,46.99 33.66,46.99
  Top 0.203: 41.75,20.8 41.75,32.38 | LCD1.5 46.46,17.68 45.56,18.57 43.97,18.57 | 33.66,46.99 27.94,46.99 arc-90 27.15,47.78 arc-74 v28.1,49.05
  Bottom 0.203: R18.2 27.62,49.53 v28.1,49.05
LCD_DATA  (via drill 0.4)
  Top 0.2: 43.97,19.05 arc-90 42.23,20.8 | 42.23,32.54 42.23,44.13 arc90 38.89,47.47 33.66,47.47
  Top 0.203: 42.23,20.8 42.23,32.54 | LCD1.4 47.06,17.71 45.72,19.05 43.97,19.05 | 33.66,47.47 28.89,47.47 arc-53 v27.94,47.94
  Bottom 0.203: v27.94,47.94 R17.2
N$1
  Top 0.2: Q5.3 59.05,18.38 R42.2
N$2
  Top 0.406: USB1.VBUS 60.63,13.01 60.33,12.7 60.33,11.43 59.05,10.16 59.05,9.62 D2.2
N$3  (via drill 0.4)
  Top 0.2: R8.2 35.08,30.96 34.77,31.27 34.77,39.37 arc90 31.11,43.02 11.91,43.02 arc-46 v10.79,43.5 | 4.45,45.09 arc90 5.4,44.13 | 4.45,50.16 arc53 3.49,52.07 arc-53 2.54,53.98
  Top 0.203: v6.51,44.13 5.4,44.13 | 4.45,45.09 4.45,50.16 | 2.54,53.98 SW2.1
  Bottom 0.2: R10.2 9.97,42.67 arc90 v10.79,43.5
  Bottom 0.203: 9.56,42.67 R10.2 9.05,42.7 arc-72 8.1,43.5 arc74 7.3,44.13 arc3 v6.51,44.13
N$4  (via drill 3.2)
  other vias: 64.14,54.61
N$5  (via drill 3.2)
  other vias: 5.71,3.81
N$6
  Bottom 0.203: IC4.7 53.34,27.94 54.61,28.57 F1.P$1
  Bottom 0.254: D1.2 55.56,26.35
  Bottom 0.305: R44.2 56.39,29.03 F1.P$1
  Bottom 0.406: D1.2 56.05,28.46 F1.P$1
N$7
  Bottom 0.2: L2.2 arc-77 49.53,43.5 arc77 R43.2 R48.2
  Bottom 0.406: SD1.4 51.6,43.65 50.8,44.45 L2.2 arc77 49.53,45.4 arc-77 C17.1 R47.2 R45.2
N$8
  Bottom 0.2: SD1.1 51.09,40.34 50.8,40.64 R48.1
N$9
  Bottom 0.2: SD1.8 51.65,48.05 51.44,48.26 R47.1
N$10
  Top 0.2: USB1.D+ 59.66,14.61 R49.1
N$11
  Bottom 0.254: R33.1 32.26,5.68 arc73 STAMP.10
N$12  (via drill 3.2)
  other vias: 64.14,3.81
N$13
  Top 0.2: LED1.A R5.2
N$14
  Bottom 0.254: R34.1 29.08,5.84 arc90 STAMP.9
N$15
  Bottom 0.254: R25.1 57.66,5.75 arc-61 STAMP.19
N$16
  Bottom 0.254: R26.1 54.48,5.75 arc-29 STAMP.18
N$17
  Bottom 0.254: R27.1 52.83,5.68 arc-73 STAMP.17
N$18
  Bottom 0.254: R28.1 49.66,5.68 arc-44 STAMP.16
N$19
  Bottom 0.254: R29.1 44.96,5.84 arc69 STAMP.15
N$20
  Bottom 0.254: R30.1 arc17 43.21,4.41 STAMP.14
N$21
  Bottom 0.254: R31.1 arc61 39.05,5.56 arc-15 41.15,3.94 STAMP.13
N$22
  Bottom 0.254: R32.1 arc103 36.2,5.4 arc-64 STAMP.12
N$23
  Bottom 0.254: R35.1 arc103 26.67,5.4 arc-80 STAMP.8
N$24
  Bottom 0.254: R36.1 arc103 23.5,5.4 arc-64 STAMP.7
N$25
  Bottom 0.254: R37.1 arc-87 26.67,8.26 23.5,8.26 arc90 21.59,6.35 arc74 STAMP.6
N$26
  Bottom 0.254: R38.1 arc-86 25.4,8.89 23.5,8.89 arc90 20.95,6.35 STAMP.5
N$27
  Bottom 0.254: R39.1 arc-84 24.13,9.53 23.5,9.53 arc90 20.32,6.35 arc-74 STAMP.4
N$28
  Bottom 0.254: R40.1 arc-57 22.86,10.16 arc80 19.68,6.35 arc-90 18.41,5.08 arc53 STAMP.3
N$29
  Top 0.2: 44.06,13.89 arc66 Q3.3
  Top 0.203: LCD1.9 44.06,13.89
N$30
  Top 0.2: LED2.A R6.2
N$31
  Top 0.2: 43.46,14.25 arc-90 42.86,13.65 arc-67 R21.1
  Top 0.203: LCD1.10 43.46,14.25
N$32
  Top 0.2: R22.1 arc-58 52.7,13.34 52.7,13.02 arc-90 50.8,11.12
  Top 0.203: Q3.1 50.8,11.12
N$33
  Top 0.203: R12.1 18.86,47.12 SW3.2
N$34
  Top 0.203: SW4.2 19.62,40.03 arc57 R13.1
N$35  (via drill 0.4)
  Top 0.203: SW5.2 v21.27,31.11 | v20.48,37.31 19.21,37.31 arc-90 18.41,38.1 arc90 16.19,40.32 13.65,40.32 arc-111 R14.1
  Bottom 0.203: v21.27,31.11 20.16,32.23 20.16,36.35 arc-37 v20.48,37.31
N$36
  Top 0.2: USB1.D- 59.49,13.8 R50.1
N$38
  Top 0.2: Q5.1 R7.2
N$44  (via drill 0.4)
  Top 0.2: 53.82,28.57 arc-28 v53.98,29.21 | 53.82,26.99 arc28 v53.98,26.35
  Top 0.203: 53.82,28.57 53.82,26.99
  Bottom 0.203: 55.81,22.1 F2.P$1 | D1.1 55.56,24.45 v53.98,26.35 | IC4.6 v53.98,29.21
  Bottom 0.406: D1.1 55.94,24.34 F2.P$1 55.17,21.46 R46.1
OSC32_IN
  Bottom 0.203: Q1.2 36.83,17.78 37.47,18.41 C4.1
  Bottom 0.254: IC2.3 35.13,19.79 arc41 Q1.2
OSC32_OUT
  Bottom 0.254: IC2.4 34.63,19.66 arc31 Q1.1 arc82 39.05,18.89 C5.1
OSC_IN
  Top 0.254: R15.2 Q2.1
  Bottom 0.254: IC2.5 34.13,17.14 arc84 Q2.1 C6.1
OSC_OUT
  Top 0.254: Q2.2 R15.1
  Bottom 0.254: IC2.6 33.63,16.66 arc17 Q2.2 arc21 42.99,9.84 C7.1
PA0  (via drill 0.4)
  Top 0.2: R16.2 C24.2 v16.03,49.21
  Top 0.203: R14.2 v15.88,41.43 R13.2 | R12.2 v16.03,49.21
  Bottom 0.2: 16.35,51.75 arc65 15.24,53.5 arc-10 STAMP.39
  Bottom 0.203: IC2.14 29.64,21.22 29.21,20.8 28.1,20.8 27.62,21.27 25.08,21.27 23.18,23.18 19.84,23.18 16.35,26.67 16.35,41.43 | 16.35,41.43 16.35,49.37 | 16.35,49.37 16.35,51.75 | v15.88,41.43 16.35,41.43 | v16.03,49.21 16.19,49.21 16.35,49.37
PA1  (via drill 0.4)
  Top 0.203: STAMP.38 arc69 18.41,52.86 21.59,52.86 arc-90 22.54,51.91 22.54,50.8 arc39 v24.13,46.35
  Bottom 0.2: 16.83,53.34 arc74 STAMP.38
  Bottom 0.203: IC2.15 29.14,21.36 29.05,21.27 28.26,21.27 27.78,21.75 25.24,21.75 23.34,23.65 20,23.65 16.83,26.83 16.83,53.34 | R19.1 v24.13,46.35
PA2  (via drill 0.4)
  Top 0.203: STAMP.37 arc53 20.95,53.34 21.59,53.34 arc-90 23.02,51.91 23.02,50.8 arc43 v24.13,47.94
  Bottom 0.2: 17.3,53.34 arc-82 STAMP.37
  Bottom 0.203: IC2.16 25.39,22.24 23.5,24.13 20.16,24.13 17.3,26.99 17.3,53.34 | R17.1 v24.13,47.94
PA3
  Bottom 0.203: IC2.17 25.3,24.19 25.08,23.97 24.29,23.97 23.65,24.61 20.32,24.61 17.78,27.15 17.78,51.59 20.8,54.61 STAMP.36
PA4  (via drill 0.4)
  Top 0.203: STAMP.35 23.5,50.8 arc53 v24.13,49.53
  Bottom 0.203: STAMP.35 22.23,53.34 20.32,53.34 18.26,51.28 18.26,27.3 20.48,25.08 23.81,25.08 24.42,25.69 IC2.20 | R18.1 v24.13,49.53
PA5
  Bottom 0.203: IC2.21 24.29,26.19 23.65,25.56 20.64,25.56 18.73,27.46 18.73,50.96 20.64,52.86 23.97,52.86 25.72,54.61 STAMP.34
PA6
  Bottom 0.203: IC2.22 24.15,26.69 23.5,26.04 20.8,26.04 19.21,27.62 19.21,50.8 20.8,52.39 24.45,52.39 25.4,53.34 26.51,53.34 27.78,54.61 STAMP.33
PA7
  Bottom 0.203: IC2.23 24.02,27.19 23.34,26.51 20.95,26.51 19.68,27.78 19.68,50.48 21.11,51.91 24.77,51.91 25.72,52.86 28.57,52.86 30.32,54.61 STAMP.32
PA8  (via drill 0.4)
  Top 0.203: v33.34,36.83 v33.34,39.85
  Bottom 0.203: IC2.41 32.63,34.86 arc-39 v33.34,36.83 | v33.34,39.85 33.34,41.59 43.97,52.23 arc-40 46.35,53.34 arc43 STAMP.25
PA15  (via drill 0.4)
  Top 0.203: v36.51,41.12 36.51,38.42 arc53 v37.94,35.56
  Bottom 0.2: v37.94,35.56 37.94,35.08 39.37,33.66 arc-37 39.69,32.7 arc-69 38.65,31.19
  Bottom 0.203: v36.51,41.12 arc90 36.83,41.43 36.83,44.45 44.13,51.75 arc-43 46.67,52.86 arc22 49.37,53.5 arc8 STAMP.24 | IC2.50 38.65,31.19
PB0  (via drill 0.4)
  Top 0.2: 23.81,21.59 arc53 23.18,22.86 arc-53 22.23,24.77
  Top 0.203: v21.27,27.3 22.23,26.35 22.23,24.77 | 23.81,21.59 23.81,15.56 arc76 24.92,14.13 arc-33 v25.72,13.65
  Bottom 0.203: IC2.26 22.18,28.69 arc76 21.43,28.1 arc4 v21.27,27.3 | R39.2 25.4,13.34 v25.72,13.65
PB1  (via drill 0.4)
  Top 0.2: 23.34,21.59 arc53 22.86,22.54 arc-53 21.75,24.77
  Top 0.203: v20.64,28.26 20.48,28.1 20.48,26.99 21.75,25.72 21.75,24.77 | 23.34,21.59 23.34,13.81 v23.5,13.65
  Bottom 0.203: IC2.27 22.2,29.19 arc61 v20.64,28.26 | R40.2 v23.5,13.65
PB3  (via drill 0.4)
  Top 0.203: v37.31,40.32 37.31,37.31 arc61 37.94,36.51 arc-33 38.58,36.04 arc-37 38.73,35.56 arc-53 38.1,34.29 arc60 v37.62,33.5
  Bottom 0.2: IC2.55 37.51,28.69 arc-90 36.35,29.84 | 36.35,31.75 arc-57 v37.62,33.5
  Bottom 0.203: v37.31,40.32 37.31,44.29 44.29,51.28 arc-45 46.99,52.39 arc26 51.91,53.5 arc5 STAMP.23 | 36.35,29.84 36.35,31.75
PB4  (via drill 0.4)
  Top 0.2: v43.5,28.42 43.18,28.1 43.18,23.5 45.72,20.95 46.51,20.95 49.05,18.41 49.69,18.41 50.64,17.46 50.64,16.67 arc90 51.31,16 R22.2
  Bottom 0.2: IC2.56 43.27,28.19 v43.5,28.42
PC0
  Bottom 0.203: IC2.8 32.63,10.07 arc34 R33.2
PC1
  Bottom 0.203: IC2.9 32.13,10.07 arc-45 R34.2 30.61,6.48
PC2
  Bottom 0.203: IC2.10 31.64,10.04 arc-36 30.96,7.94 arc-55 30,7.46 arc49 R35.2
PC3
  Bottom 0.203: 24.26,6.48 R36.2 arc-38 29.69,7.94 arc58 30.64,8.41 arc34 31.14,10.02 IC2.11
PC4  (via drill 0.4)
  Top 0.2: 24.77,21.59 arc53 23.81,23.5 arc-53 23.18,24.77
  Top 0.203: v23.18,27.46 23.18,24.77 | 24.77,21.59 24.77,16.51 arc83 26.04,15.08 arc-45 27.46,14.29 arc63 v29.21,13.65
  Bottom 0.203: IC2.24 23.4,27.69 v23.18,27.46 | R37.2 v29.21,13.65
PC5  (via drill 0.4)
  Top 0.2: 24.29,21.59 arc53 23.5,23.18 arc-57 22.7,24.92
  Top 0.203: v22.23,27.94 22.23,27.15 22.7,26.67 22.7,24.92 22.7,24.77 | 24.29,21.59 24.29,15.72 arc90 25.4,14.61 arc-67 v26.83,13.65
  Bottom 0.203: IC2.25 22.48,28.19 v22.23,27.94 | v26.83,13.65 27.3,13.18 R38.2
PC13  (via drill 0.4)
  Top 0.2: 55.72,52.7 arc-45 STAMP.22 | 50.16,17.14 50.16,16.67 arc90 51.59,15.24 52.55,15.24 arc90 52.86,15.56 52.86,16.35 arc53 52.7,16.67 arc-26 52.23,17.78 arc-10 52.07,19.53 arc25 51.75,20.95 arc-27 51.44,22.54 | 51.44,35.56 arc-62 53.34,38.73 arc62 55.72,42.7
  Top 0.203: 50.16,17.14 49.53,17.78 48.9,17.78 46.2,20.48 44.29,20.48 v43.97,20.8 | 51.44,22.54 51.44,35.56 | 55.72,42.7 55.72,52.7
  Bottom 0.203: IC2.2 35.63,20.56 arc90 36.51,19.68 40.32,19.68 arc34 v43.97,20.8
RS485_A
  Bottom 0.61: F2.P$2 59.63,24.07 62.87,27.3 X1.2
RS485_B
  Bottom 0.61: X1.1 61.59,31.11 59.69,29.84 F1.P$2
RXD1  (via drill 0.4)
  Top 0.2: 27.15,33.81 arc-58 v31.43,31.43
  Top 0.203: 27.15,33.81 7.62,33.81 arc90 4.92,31.11 4.92,27.94 arc-51 3.17,24.29 arc54 JP1.3
  Bottom 0.203: IC2.43 33.63,33 arc-90 32.07,31.43 v31.43,31.43
  Bottom 0.305: R23.1 3.05,23.37 JP1.3
RXD3  (via drill 0.4)
  Top 0.2: v47.62,30.48 v47.62,26.67
  Bottom 0.2: IC4.1 v47.62,26.67 | 41.75,31.11 46.83,31.11 arc-77 v47.62,30.48
  Bottom 0.203: IC2.52 40.83,30.19 41.75,31.11
SCL2  (via drill 0.4)
  Top 0.203: v22.07,35.08 v12.7,35.08
  Bottom 0.2: 20.16,41.75 arc58 20.95,40.32 arc-60 22.07,38.26
  Bottom 0.203: IC2.29 24.74,30.19 arc-90 23.34,31.59 23.34,32.07 arc42 v22.07,35.08 22.07,38.26 | v12.7,35.08 12.7,33.66 arc-90 12.06,33.02 R3.1 | 20.16,41.75 20.16,50.16 21.43,51.44 25.08,51.44 26.04,52.39 32.38,52.39 33.66,53.66 STAMP.31
  Bottom 0.254: R3.1 11.75,32.83 11.75,31.75 arc96 IC1.6
SDA2  (via drill 0.4)
  Top 0.203: v22.86,35.88 22.23,35.88 arc19 21.27,35.72 arc-19 20.32,35.56 13.97,35.56 arc-44 v12.38,36.2
  Bottom 0.2: v22.86,35.88 22.54,36.2 22.54,38.89 arc63 21.43,40.64 arc-64 20.64,41.91
  Bottom 0.203: IC2.30 24.71,30.69 arc-90 23.81,31.59 23.81,32.07 arc26 v22.86,35.88 | R4.1 11.56,34.73 arc-59 v12.38,36.2 arc-90 13.49,35.08 13.49,31.49 IC1.5 | 20.64,41.91 20.64,49.85 21.75,50.96 25.4,50.96 26.35,51.91 32.86,51.91 35.56,54.61 STAMP.30
  Bottom 0.254: IC1.5 13.34,31.11
SPI2_MISO  (via drill 0.4)
  Top 0.2: v52.07,46.99 arc46 50.96,47.47 49.05,47.47 44.45,52.07 arc-62 STAMP.27
  Bottom 0.2: SD1.7 52.12,46.95 v52.07,46.99
  Bottom 0.203: IC2.35 29.64,39.16 43.18,52.7 arc53 STAMP.27
SPI2_MOSI  (via drill 0.4)
  Top 0.2: v52.07,42.55 arc46 53.02,44.77 53.02,46.99 arc90 52.07,47.94 49.21,47.94 45.09,52.07 arc-90 45.09,53.98 arc-37 STAMP.26
  Bottom 0.2: SD1.3 v52.07,42.55
  Bottom 0.203: IC2.36 30.14,39.02 43.81,52.7 arc-16 STAMP.26
SPI2_NSS
  Bottom 0.203: IC2.33 28.64,39.43 40.64,51.44 40.64,53.34 39.37,54.61 STAMP.29
SPI2_SCLK  (via drill 0.4)
  Top 0.2: STAMP.28 48.9,46.99 50.01,46.99 arc-42 51.44,46.35 arc-46 v52.07,44.77
  Bottom 0.2: SD1.5 52.09,44.74 v52.07,44.77
  Bottom 0.203: IC2.34 29.14,39.3 41.27,51.44 STAMP.28
SWCLK  (via drill 0.4)
  Top 0.203: SWD1.2 arc-33 4.76,41.75 arc22 5.71,41.59 arc83 8.26,43.97 arc-87 9.53,45.09 arc5 10.16,45.09 arc-46 11.43,44.61 arc44 13.02,43.97 31.11,43.97 arc-90 35.72,39.37 35.72,36.83 arc74 36.2,36.2 arc-57 v36.83,35.56
  Bottom 0.2: 37.78,34.61 38.89,33.5 arc-44 39.21,32.7 arc-96 IC2.49
  Bottom 0.203: R1.1 4.64,40.96 arc-46 SWD1.2 | v36.83,35.56 37.78,34.61
SWDIO  (via drill 0.4)
  Top 0.2: 4.45,38.86 arc-90 SWD1.4
  Top 0.203: 4.45,38.86 v4.45,39.37 arc-18 4.45,40.01 arc-82 5.59,40.96 arc87 8.73,43.81 arc-82 9.53,44.61 arc-45 11.43,43.97 arc41 12.7,43.5 31.11,43.5 arc-90 35.24,39.37 35.24,36.83 arc41 v35.72,35.56
  Bottom 0.203: IC2.46 35.13,34.5 arc-58 v35.72,35.56 | v4.45,39.37 R2.1
TIM3_CH1  (via drill 0.4)
  Top 0.2: 51.59,19.53 arc25 51.28,20.95 arc-25 50.96,22.38
  Top 0.203: v51.44,17.62 51.59,17.78 51.59,19.53 | 50.96,22.38 50.96,35.24 arc90 48.58,37.62 arc-61 46.67,38.73 arc31 v45.72,39.69
  Bottom 0.203: IC2.37 30.64,36.98 arc-90 32.7,39.05 41.59,39.05 arc53 42.23,39.37 arc-53 42.86,39.69 v45.72,39.69 | v51.44,17.62 50.96,17.14 50.96,10.79 arc30 51.59,8.41 arc61 52.7,7.78 arc-1 54.61,7.78 arc-27 55.88,7.46 arc27 57.15,7.14 arc1 58.26,7.14 arc-83 R25.2
TIM3_CH2  (via drill 0.4)
  Top 0.2: 51.12,19.53 arc25 50.8,20.95 arc-25 50.48,22.38
  Top 0.203: v50.8,18.57 51.12,18.89 51.12,19.53 | 50.48,22.38 50.48,35.24 arc90 48.58,37.15 arc-37 v46.2,37.94
  Bottom 0.203: IC2.38 31.14,36.85 arc-90 32.86,38.58 41.91,38.58 arc53 42.55,38.89 arc-53 43.18,39.21 44.61,39.21 arc-77 v46.2,37.94 | v50.8,18.57 50.48,18.26 50.48,10.79 arc28 51.12,8.26 arc62 52.7,7.3 54.93,7.3 arc-83 R26.2
TIM3_CH3  (via drill 0.4)
  Top 0.2: 50.32,20.32 arc28 50.16,20.95 arc-28 50.01,21.59
  Top 0.203: v50.32,19.53 50.32,20.32 | 50.01,21.59 50.01,35.24 arc90 48.58,36.67 47.31,36.67 arc-71 v45.09,38.26
  Bottom 0.2: 42.23,38.1 arc25 43.66,38.42 arc-63 v45.09,38.26
  Bottom 0.203: IC2.39 31.64,36.72 arc-90 33.02,38.1 42.23,38.1 | v50.32,19.53 50.01,19.21 50.01,10.79 arc33 R27.2
TIM3_CH4  (via drill 0.4)
  Top 0.203: v49.53,20.32 49.53,35.24 arc90 48.58,36.2 47.31,36.2 arc-53 v44.13,37.78
  Bottom 0.203: IC2.40 32.13,36.58 arc-90 33.18,37.62 43.97,37.62 v44.13,37.78 | v49.53,20.32 49.53,10.16 arc-40 R28.2
TIM4_CH1
  Bottom 0.203: IC2.58 40.12,27.19 arc-41 42.39,26.35 47.62,21.11 arc-46 49.05,17.78 49.05,10.16 arc-58 47.31,6.99 arc10 R29.2
TIM4_CH2
  Bottom 0.203: IC2.59 40.14,26.69 arc-43 42.23,25.88 47.62,20.48 arc-39 48.58,17.78 48.58,10.16 arc-93 45.4,7.14 arc20 44.13,6.99 arc41 R30.2
TIM4_CH3
  Bottom 0.203: IC2.61 40.03,25.69 arc-45 43.02,24.45 46.99,20.48 arc-45 48.1,17.78 48.1,10.16 arc-90 45.72,7.78 arc16 41.12,7.14 arc46 R31.2
TIM4_CH4
  Bottom 0.203: IC2.62 40.06,25.19 arc-44 42.7,24.13 46.75,20.08 arc-42 47.62,17.78 47.62,10.16 arc-90 45.88,8.41 arc18 40.8,7.62 arc-19 38.58,7.3 arc64 R32.2
TXD1  (via drill 0.4)
  Top 0.2: 26.99,34.29 arc-44 v32.07,32.23
  Top 0.203: 26.99,34.29 7.62,34.29 arc90 4.45,31.11 4.45,27.94 arc-74 JP1.2
  Bottom 0.203: IC2.42 33.13,32.98 arc-90 32.38,32.23 v32.07,32.23
TXD3
  Bottom 0.2: 41.59,31.59 46.35,31.59 arc36 R41.2 arc-42 48.42,30.51 arc-35 48.18,29.77 arc-53 47.15,29.21 arc-4 IC4.3
  Bottom 0.203: IC2.51 40.69,30.69 41.59,31.59
  Bottom 0.254: IC4.3 IC4.2
USB_DM  (via drill 0.4)
  Top 0.2: v46.35,34.61 46.35,26.04 v48.26,24.13 | v56.52,13.65 56.67,13.49 R50.2 arc88 58.42,12.7 arc-88 C18.1
  Bottom 0.2: v48.26,24.13 54.29,18.1 arc-37 54.61,17.14 arc57 v56.52,13.65 | 43.81,36.99 arc-90 45.88,34.92 arc113 v46.35,34.61
  Bottom 0.203: IC2.44 34.13,34.92 arc-90 36.2,36.99 43.81,36.99
USB_DP  (via drill 0.4)
  Top 0.2: v45.4,33.97 45.88,33.5 45.88,25.88 46.99,24.77 v46.99,24.13 | R42.1 C19.1 R49.2 56.67,15.08 v56.52,14.92
  Bottom 0.2: 43.81,36.51 arc-90 45.4,34.92 v45.4,33.97 | v46.99,24.13 arc-64 48.26,24.92 arc-53 48.9,24.61 arc8 51.04,22.15 54.61,18.57 arc-37 55.09,17.14 arc65 v56.52,14.92
  Bottom 0.203: IC2.45 34.63,34.92 arc-91 36.2,36.51 43.81,36.51
VBAT  (via drill 0.4)
  Top 0.203: 25.72,20.16 v25.72,19.84 25.72,18.26 arc90 27.46,16.51 30.48,16.51 arc46 32.7,17.46 34.61,19.37 arc-18 v36.35,20.64 | v16.51,21.59 16.51,22.07 G1.+
  Bottom 0.2: 23.18,19.84 arc-53 20.95,20.95 arc53 19.68,21.59
  Bottom 0.203: IC2.1 36.13,20.86 v36.35,20.64 | 19.68,21.59 v16.51,21.59 | v25.72,19.84 23.18,19.84
  Bottom 0.254: 36.15,22.23 IC2.1
VDDA  (via drill 0.4)
  Top 0.2: C24.1 13.37,48.87 arc-53 SW3.1 12.7,46.35 arc-90 13.65,45.4 v13.65,45.09
  Top 0.203: SW3.1 12.44,46.3 | v13.65,38.73 SW4.1 | SW5.1 12.38,31.11 v14.29,32.38
  Top 0.254: v30.32,20.32 30.48,20.48 C11.1 arc103 31.43,22.23 31.43,24.13 arc41 30.96,25.4 arc-41 30.48,26.67 30.48,30.16 arc90 27.46,33.18 16.35,33.18 arc42 v14.29,32.38
  Bottom 0.203: v13.65,45.09 v13.65,38.73 13.97,38.42 13.97,33.34 arc37 v14.29,32.38
  Bottom 0.254: IC2.13 30.14,20.66 v30.32,20.32 L1.2

### Text on the board
tPlace: SYS | RST | 3V3 | PA0 | PA1 | PA2 | PA3 | PA4 | PA5 | PA6 | PA7 | SCL | SDA | !SS | CLK | MISO | MOSI | PA8 | PA15 | PD2 | PC13 | GND | I2C 2 | SPI2 | MicroSD | RS485 | B- | A+ | GND | UART | Pwr | Stat | T4.4 | T4.3 | T4.2 | T4.1 | T3.4 | T3.3 | T3.2 | T3.1 | +5V | PB1 | PB0 | PC5 | PC4 | PC3 | PC2 | PC1 | PC0 | PB9 | PB8 | PB7 | PB6 | PC9 | PC8 | PC7 | PC6 | GND | GND | GND
bPlace: STM32 USB stamp module Rev.A | tuxotronic.org